# Altium schematic sheet pca10184_top_level.SchDoc: =ProductName
size A3; DocumentNumber: 1; SheetNumber: 1; SheetTotal: 9
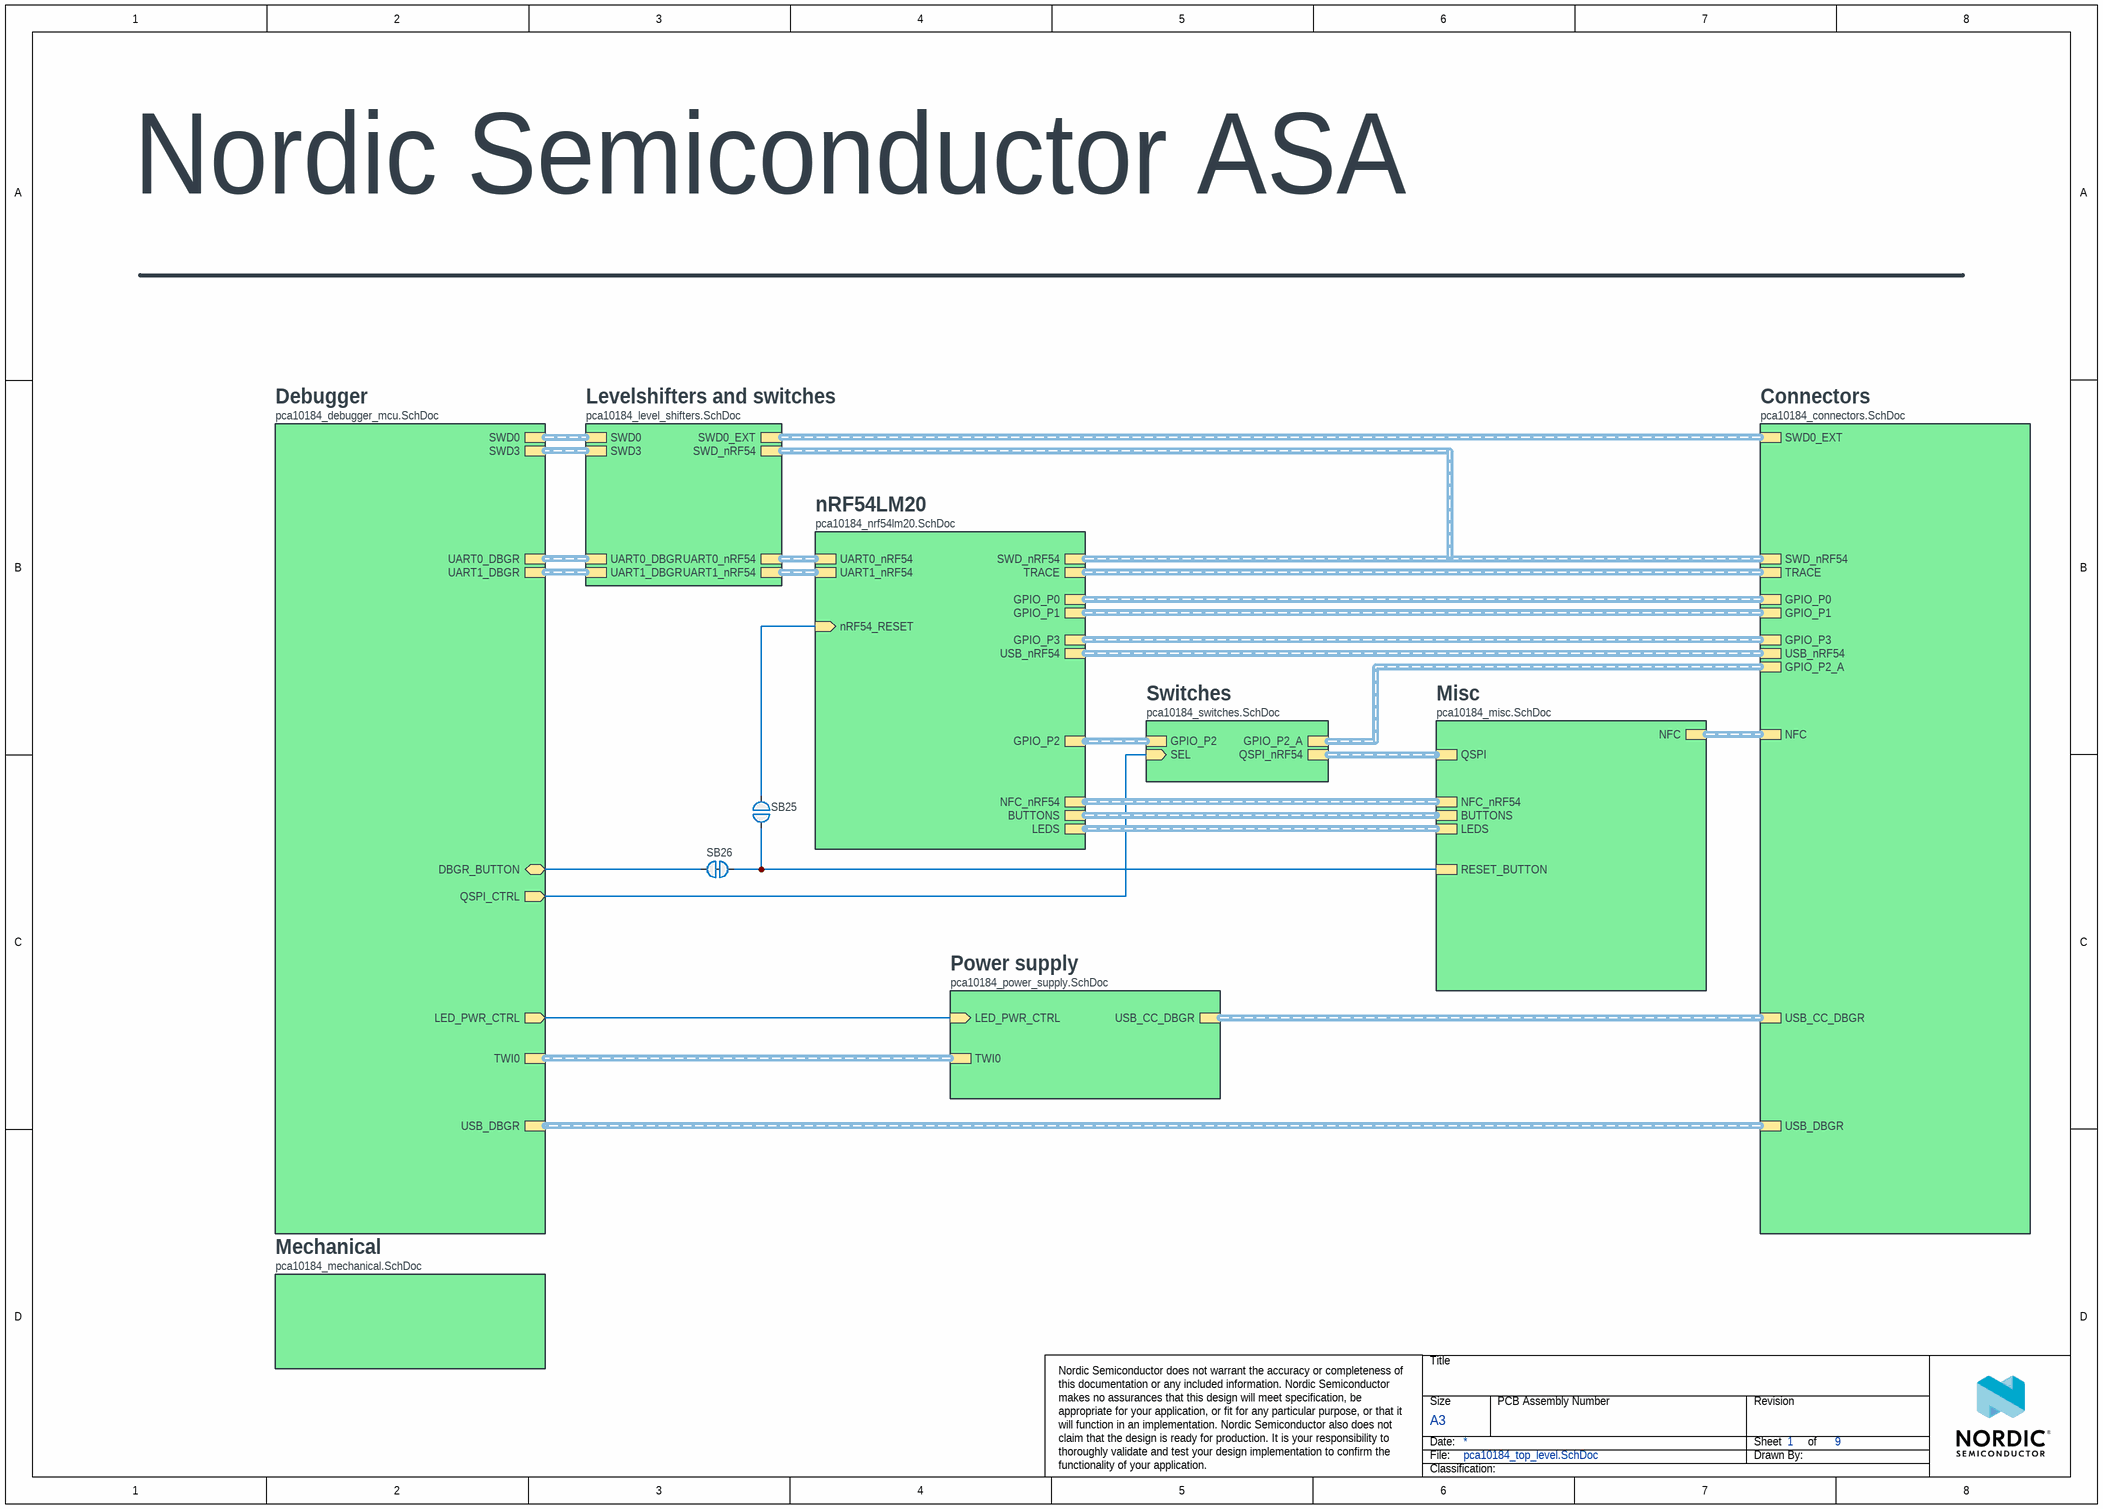
[diagram p0: pca10184_top_level.SchDoc]

## Parts
SB25  Solderbridge  [Solderbridge]  (value not drawn)  (no BOM)
SB26  Solderbridge  [Solderbridge_Shorted]  (value not drawn)  (net tie, no BOM)

## Sub-sheets
Connectors = pca10184_connectors.SchDoc: SWD_nRF54 (harness SWD), NFC (harness NFC), GPIO_P0 (harness GPIO_P0), GPIO_P1 (harness GPIO_P1), GPIO_P3 (harness GPIO_P3), SWD0_EXT (harness SWD), USB_nRF54 (harness USB), USB_DBGR (harness USB), USB_CC_DBGR (harness USB_CC), TRACE (harness TRACE), GPIO_P2_A (harness GPIO_P2)
Debugger = pca10184_debugger_mcu.SchDoc: UART0_DBGR (harness UART_DBGR), UART1_DBGR (harness UART_DBGR), SWD0 (harness SWD), SWD3 (harness SWD), USB_DBGR (harness USB), TWI0 (harness TWI), DBGR_BUTTON (bidir), LED_PWR_CTRL (out), QSPI_CTRL (out)
Levelshifters and switches = pca10184_level_shifters.SchDoc: SWD0 (harness SWD), SWD0_EXT (harness SWD), UART0_nRF54 (harness UART), UART1_nRF54 (harness UART), SWD3 (harness SWD), SWD_nRF54 (harness SWD), UART0_DBGR (harness UART_DBGR), UART1_DBGR (harness UART_DBGR)
Mechanical = pca10184_mechanical.SchDoc: no entries
Misc = pca10184_misc.SchDoc: NFC_nRF54 (harness NFC), NFC (harness NFC), BUTTONS (harness BUTTONS), LEDS (harness LEDS), QSPI (harness QSPI), RESET_BUTTON
nRF54LM20 = pca10184_nrf54lm20.SchDoc: GPIO_P0 (harness GPIO_P0), GPIO_P1 (harness GPIO_P1), GPIO_P2 (harness GPIO_P2), GPIO_P3 (harness GPIO_P3), USB_nRF54 (harness USB), BUTTONS (harness BUTTONS), LEDS (harness LEDS), NFC_nRF54 (harness NFC), UART0_nRF54 (harness UART), UART1_nRF54 (harness UART), SWD_nRF54 (harness SWD), TRACE (harness TRACE), nRF54_RESET (in)
Power supply = pca10184_power_supply.SchDoc: TWI0 (harness TWI), LED_PWR_CTRL (in), USB_CC_DBGR (harness USB_CC)
Switches = pca10184_switches.SchDoc: GPIO_P2 (harness GPIO_P2), GPIO_P2_A (harness GPIO_P2), QSPI_nRF54 (harness QSPI), SEL (in)

## Nets
NetSB25_1: SB25.1 ; sheet nRF54LM20/nRF54_RESET
NetSB25_2: SB25.2 SB26.1 ; sheet Misc/RESET_BUTTON
NetSB26_2: SB26.2 ; sheet Debugger/DBGR_BUTTON
(unnamed): sheet Debugger/LED_PWR_CTRL, sheet Power supply/LED_PWR_CTRL
(unnamed): sheet Debugger/QSPI_CTRL, sheet Switches/SEL

## Buses and harness runs
harness sheet Connectors/GPIO_P0 = sheet nRF54LM20/GPIO_P0
harness sheet Connectors/GPIO_P1 = sheet nRF54LM20/GPIO_P1
harness sheet Connectors/GPIO_P2_A = sheet Switches/GPIO_P2_A
harness sheet Connectors/GPIO_P3 = sheet nRF54LM20/GPIO_P3
harness sheet Connectors/NFC = sheet Misc/NFC
harness sheet Connectors/SWD0_EXT = sheet Levelshifters and switches/SWD0_EXT
harness sheet Connectors/SWD_nRF54 = sheet Levelshifters and switches/SWD_nRF54 = sheet nRF54LM20/SWD_nRF54
harness sheet Connectors/TRACE = sheet nRF54LM20/TRACE
harness sheet Connectors/USB_CC_DBGR = sheet Power supply/USB_CC_DBGR
harness sheet Connectors/USB_DBGR = sheet Debugger/USB_DBGR
harness sheet Connectors/USB_nRF54 = sheet nRF54LM20/USB_nRF54
harness sheet Debugger/SWD0 = sheet Levelshifters and switches/SWD0
harness sheet Debugger/SWD3 = sheet Levelshifters and switches/SWD3
harness sheet Debugger/TWI0 = sheet Power supply/TWI0
harness sheet Debugger/UART0_DBGR = sheet Levelshifters and switches/UART0_DBGR
harness sheet Debugger/UART1_DBGR = sheet Levelshifters and switches/UART1_DBGR
harness sheet Levelshifters and switches/UART0_nRF54 = sheet nRF54LM20/UART0_nRF54
harness sheet Levelshifters and switches/UART1_nRF54 = sheet nRF54LM20/UART1_nRF54
harness sheet Misc/BUTTONS = sheet nRF54LM20/BUTTONS
harness sheet Misc/LEDS = sheet nRF54LM20/LEDS
harness sheet Misc/NFC_nRF54 = sheet nRF54LM20/NFC_nRF54
harness sheet Misc/QSPI = sheet Switches/QSPI_nRF54
harness sheet nRF54LM20/GPIO_P2 = sheet Switches/GPIO_P2

## Notes on the sheet
- Nordic Semiconductor ASA
- Title
- Size
- Date:
- File:
- A3
- PCB Assembly Number
- Sheet
- Drawn By:
- Revision
- of
- Nordic Semiconductor does not warrant the accuracy or completeness of this documentation or any included information. Nordic Semiconductor makes no assurances that this design will meet specification, be appropriate for your application, or fit for any particular purpose, or that it will function in an implementation. Nordic Semiconductor also does not claim that the design is ready for production. It is your responsibility to thoroughly validate and test your design implementation to confirm the functionality of your application.
  © Nordic Semiconductor — All rights reserved.
- Classification:

## Library data of the parts
SB25 = Solderbridge: Manufacturer: N.A.; Part number NEMS: 100500458; Pad Count: 2; Component Status: Active; System: Connector; Part Number: Solderbridge; Manufacturer Part Number: N.A.; LatestRevisionDate: 2009-12-14; Published: 2009-12-14; Value: Solderbridge; Note: N.A.; Artikkelnr Noca: N.A.; Footprint Doc: Solderbridge; Part number IPS: N.A.; ComponentLink1URL: N.A.; ComponentLink1Description: Datasheet; ComponentLink2URL: N.A.; ComponentLink2Description: Supplier link; HelpURL: N.A.; Supplier 1: N.A.; Supplier Part Number 1: N.A.; Supplier 2: N.A.; Supplier Part Number 2: N.A.; Component Class: Connectors; PartId: 100500458; Author: rsk; Part number Norautron: N.A.
SB26 = Solderbridge Shorted: Shorted Solderbridge; Manufacturer: N.A.; Part number NEMS: 100500459; Pad Count: 2; Component Status: Active; System: Connector; Part Number: Solderbridge Shorted; Manufacturer Part Number: N.A.; LatestRevisionDate: 2012-08-07; Published: 2012-08-07; Value: Solderbridge; Note: N.A.; Artikkelnr Noca: N.A.; Footprint Doc: Solderbridge_Shorted; Part number IPS: N.A.; ComponentLink1URL: N.A.; ComponentLink1Description: Datasheet; ComponentLink2URL: N.A.; ComponentLink2Description: Supplier link; HelpURL: N.A.; Supplier 1: N.A.; Supplier Part Number 1: N.A.; Supplier 2: N.A.; Supplier Part Number 2: N.A.; Component Class: Connectors; PartId: 100500459; Author: rsk; Part number Norautron: N.A.